# Altium schematic sheet IV18InCase.SchDoc
size A3
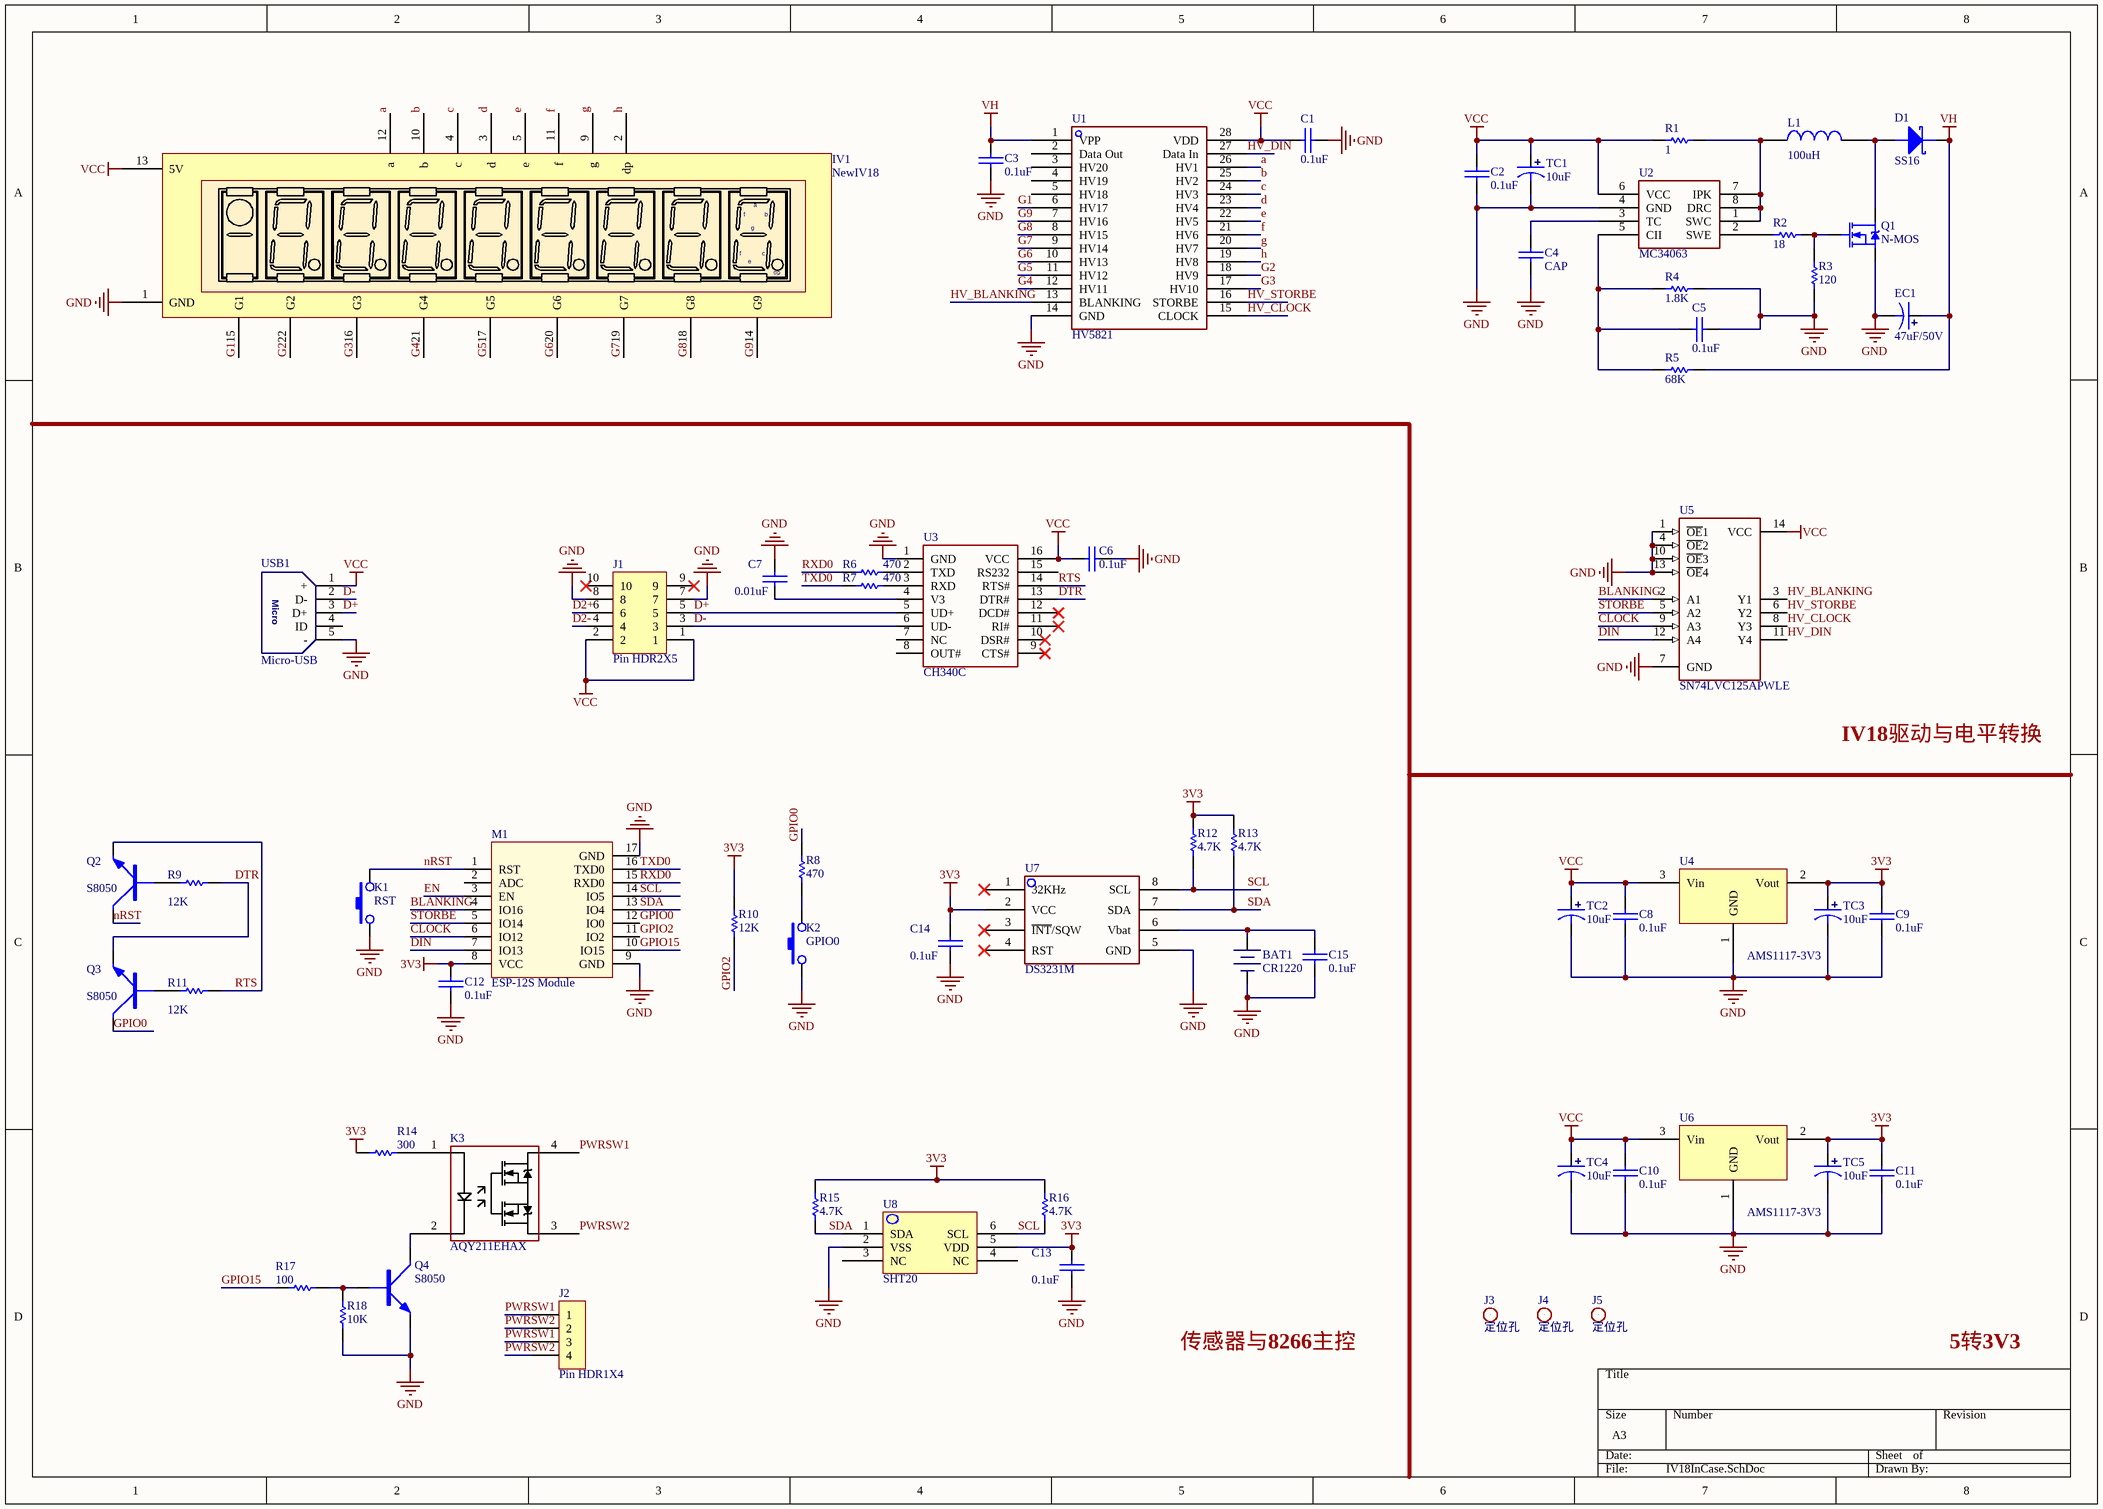
[diagram p0: IV18InCase.SchDoc]

## Parts
BAT1  CR1220  [CR1220-B]
C1  0.1uF  [0603C]
C2  0.1uF  [0603C]
C3  0.1uF  [0603C]
C4  CAP  [0603C]
C5  0.1uF  [0603C]
C6  0.1uF  [0603C]
C7  0.01uF  [0603C]
C8  0.1uF  [0603C]
C9  0.1uF  [0603C]
C10  0.1uF  [0603C]
C11  0.1uF  [0603C]
C12  0.1uF  [0603C]
C13  0.1uF  [0603C]
C14  0.1uF  [0603C]
C15  0.1uF  [0603C]
D1  SS16  [SMA/DO-214AC]
EC1  47uF/50V  [SMD-EC3.0X3.3X5.4]
IV1  NewIV18  [NEWIV18-正向]
J1  Pin HDR2X5  [Pin HDR2X5/2.54mm-S]
J2  Pin HDR1X4  [Pin HDR1X4/2.54mm-S]
J3  定位孔  [铜柱定位孔]
J4  定位孔  [铜柱定位孔]
J5  定位孔  [铜柱定位孔]
K1  RST  [SMD-3X6X2.5]
K2  GPIO0  [SMD-3X6X2.5]
K3  AQY211EHAX  [SMD4]
L1  100uH  [CD32]
M1  ESP-12S Module  [ESP-12S Module]
Q1  N-MOS  [TO252]
Q2  S8050  [SOT-23]
Q3  S8050  [SOT-23]
Q4  S8050  [SOT-23]
R1  1  [0603R]
R2  18  [0603R]
R3  120  [0603R]
R4  1.8K  [0603R]
R5  68K  [0603R]
R6  470  [0603R]
R7  470  [0603R]
R8  470  [0603R]
R9  12K  [0603R]
R10  12K  [0603R]
R11  12K  [0603R]
R12  4.7K  [0603R]
R13  4.7K  [0603R]
R14  300  [0603R]
R15  4.7K  [0603R]
R16  4.7K  [0603R]
R17  100  [0603R]
R18  10K  [0603R]
TC1  10uF  [TAJ-A/3216]
TC2  10uF  [TAJ-A/3216]
TC3  10uF  [TAJ-A/3216]
TC4  10uF  [TAJ-A/3216]
TC5  10uF  [TAJ-A/3216]
U1  HV5821  [SOIC_28W]
U2  MC34063  [SOP8]
U3  CH340C  [SOP16]
U4  AMS1117-3V3  [SOT223]
U5  SN74LVC125APWLE  [TSSOP14]
U6  AMS1117-3V3  [SOT223]
U7  DS3231M  [SOP8]
U8  SHT20  [SHT-20]
USB1  Micro-USB  [USB-MICRO_A]

## Nets
3V3: C9.2 C11.2 C12.2 C13.2 C14.2 M1.8(VCC) R10.2 R12.2 R13.2 R14.1 R15.2 R16.2 TC3.1 TC5.1 U4.2(Vout) U6.2(Vout) U7.2(VCC) U8.5(VDD)
GND: BAT1.2 C1.1 C2.1 C3.1 C4.1 C5.1 C6.1 C7.1 C8.1 C9.1 C10.1 C11.1 C12.1 C13.1 C14.1 C15.1 EC1.2 IV1.1(GND) J1.7 J1.8 K1.1 K2.1 M1.9(GND) M1.17(GND) Q1.S Q4.E R3.1 R4.2 R18.1 TC1.2 TC2.2 TC3.2 TC4.2 TC5.2 U1.14(GND) U2.4(GND) U3.1(GND) U4.1(GND) U5.1(~{OE}1) U5.4(~{OE}2) U5.7(GND) U5.10(~{OE}3) U5.13(~{OE}4) U6.1(GND) U7.5(GND) U8.2(VSS) USB1.5(-)
VCC: C1.2 C2.2 C6.2 C8.2 C10.2 IV1.13(5V) J1.1 J1.2 R1.1 TC1.1 TC2.1 TC4.1 U1.28(VDD) U2.6(VCC) U3.16(VCC) U4.3(Vin) U5.14(VCC) U6.3(Vin) USB1.1(+)
VH: C3.2 D1.K EC1.1 R5.2 U1.1(VPP)
a: IV1.12(a) U1.26(HV1)
b: IV1.10(b) U1.25(HV2)
BLANKING: M1.4(IO16) U5.2(A1)
c: IV1.4(c) U1.24(HV3)
CLOCK: M1.6(IO12) U5.9(A3)
d: IV1.3(d) U1.23(HV4)
D2+: J1.6
D2-: J1.4
D+: J1.5 U3.5(UD+) USB1.3(D+)
D-: J1.3 U3.6(UD-) USB1.2(D-)
DIN: M1.7(IO13) U5.12(A4)
DTR: Q3.E R9.2 U3.13(DTR#)
e: IV1.5(e) U1.22(HV5)
EN: M1.3(EN)
f: IV1.11(f) U1.21(HV6)
g: IV1.9(g) U1.20(HV7)
G1: IV1.15(G1) U1.6(HV17)
G2: IV1.22(G2) U1.18(HV9)
G3: IV1.16(G3) U1.17(HV10)
G4: IV1.21(G4) U1.12(HV11)
G5: IV1.17(G5) U1.11(HV12)
G6: IV1.20(G6) U1.10(HV13)
G7: IV1.19(G7) U1.9(HV14)
G8: IV1.18(G8) U1.8(HV15)
G9: IV1.14(G9) U1.7(HV16)
GPIO0: M1.12(IO0) Q3.C R8.2
GPIO2: M1.11(IO2) R10.1
GPIO15: M1.10(IO15) R17.1
h: IV1.2(dp) U1.19(HV8)
HV_BLANKING: U1.13(BLANKING) U5.3(Y1)
HV_CLOCK: U1.15(CLOCK) U5.8(Y3)
HV_DIN: U1.27(Data_In) U5.11(Y4)
HV_STORBE: U1.16(STORBE) U5.6(Y2)
nRST: K1.3 M1.1(RST) Q2.C
PWRSW1: J2.1 J2.3 K3.4
PWRSW2: J2.2 J2.4 K3.3
RTS: Q2.E R11.2 U3.14(RTS#)
RXD0: M1.15(RXD0) R6.1
SCL: M1.14(IO5) R12.1 R16.1 U7.8(SCL) U8.6(SCL)
SDA: M1.13(IO4) R13.1 R15.1 U7.7(SDA) U8.1(SDA)
STORBE: M1.5(IO14) U5.5(A2)
TXD0: M1.16(TXD0) R7.1
NetBAT1_1: BAT1.1 C15.2 U7.6(Vbat)
NetC4_2: C4.2 U2.3(TC)
NetC5_2: C5.2 R4.1 R5.1 U2.5(CII)
NetC7_2: C7.2 U3.4(V3)
NetD1_A: D1.A L1.2 Q1.D
NetK2_3: K2.3 R8.1
NetK3_1: K3.1 R14.2
NetK3_2: K3.2 Q4.C
NetL1_1: L1.1 R1.2 U2.1(SWC) U2.7(IPK) U2.8(DRC)
NetQ1_G: Q1.G R2.2 R3.2
NetQ2_B: Q2.B R9.1
NetQ3_B: Q3.B R11.1
NetQ4_B: Q4.B R17.2 R18.2
NetR2_1: R2.1 U2.2(SWE)
NetR6_2: R6.2 U3.2(TXD)
NetR7_2: R7.2 U3.3(RXD)

Not connected (* = marked no-connect by the designer): J1 9* 10*; J3 1; J4 1; J5 1; M1 2(ADC); U1 2(Data_Out) 3(HV20) 4(HV19) 5(HV18); U3 7(NC) 8(OUT#) 9(CTS#)* 10(DSR#)* 11(RI#)* 12(DCD#)* 15(RS232); U7 1(32KHz)* 3(~{INT}/SQW)* 4(RST)*; U8 3(NC) 4(NC); USB1 4(ID)

## Notes on the sheet
- IV18驱动与电平转换
- 传感器与8266主控
- 5转3V3
- (in symbol Micro-USB) Micro

## Library data of the parts
C1-C15 = CAP: 无极性电容
D1 = DIODE SCHOTTKY: 肖特基二极管
EC1 = SMD_ECAP: 贴片电解电容
K1 K2 = KEY
L1 = INDUCTOR
Q1 = N-MOS: N沟道场效应管
Q2-Q4 = NPN: NPN三极管
R1-R18 = RES
TC1-TC5 = TCAP: 钽电容
U4 U6 = AMS1117: 三端稳压芯片